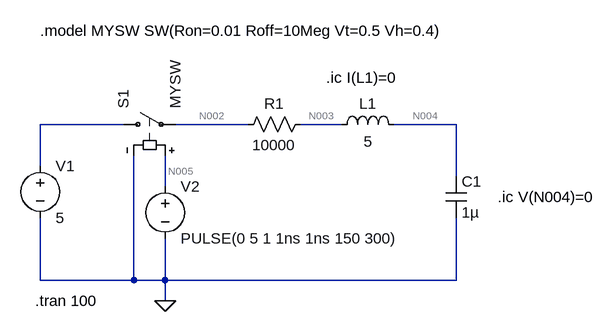
[diagram p0: schematic Transient_RLC.asc]
Transient_RLC.asc, the LTspice schematic file:
Version 4
SHEET 1 880 680
WIRE 64 64 -64 64
WIRE 256 64 144 64
WIRE 400 64 336 64
WIRE 576 64 480 64
WIRE -64 128 -64 64
WIRE 576 144 576 64
WIRE 128 160 128 112
WIRE -64 304 -64 208
WIRE 80 304 80 112
WIRE 80 304 -64 304
WIRE 128 304 128 240
WIRE 128 304 80 304
WIRE 576 304 576 208
WIRE 576 304 128 304
WIRE 128 336 128 304
FLAG 128 336 0
SYMBOL res 240 80 R270
WINDOW 0 32 56 VTop 2
WINDOW 3 0 56 VBottom 2
SYMATTR InstName R1
SYMATTR Value 10000
SYMBOL ind 384 80 R270
WINDOW 0 32 56 VTop 2
WINDOW 3 5 56 VBottom 2
SYMATTR InstName L1
SYMATTR Value 5
SYMBOL voltage -64 112 R0
SYMATTR InstName V1
SYMATTR Value 5
SYMBOL sw 48 64 R270
SYMATTR InstName S1
SYMATTR Value MYSW
SYMBOL voltage 128 144 R0
WINDOW 123 0 0 Left 0
WINDOW 39 0 0 Left 0
SYMATTR InstName V2
SYMATTR Value PULSE(0 5 1 1ns 1ns 150 300)
SYMBOL cap 560 144 R0
SYMATTR InstName C1
SYMATTR Value 1µ
TEXT -64 -80 Left 2 !.model MYSW SW(Ron=0.01 Roff=10Meg Vt=0.5 Vh=0.4)
TEXT -72 336 Left 2 !.tran 100
TEXT 376 -8 Left 2 !.ic I(L1)=0
TEXT 640 176 Left 2 !.ic V(N004)=0

The netlist it stands for:
* Transient_RLC.asc
R1 N002 N003 10000
L1 N003 N004 5
V1 N001 0 5
S1 N001 N002 N005 0 MYSW
V2 N005 0 PULSE(0 5 1 1ns 1ns 150 300)
C1 N004 0 1µ
.model MYSW SW(Ron=0.01 Roff=10Meg Vt=0.5 Vh=0.4)
.tran 100
.ic I(L1)=0
.ic V(N004)=0
.backanno
.end

* Results of the author's LTspice run, read from the files saved beside the schematic
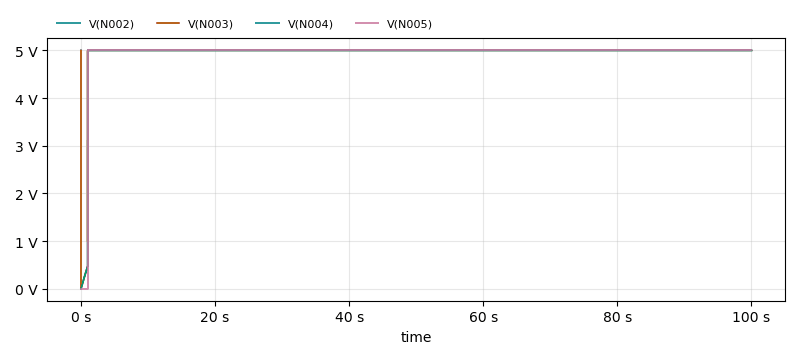
[diagram p1: Transient Analysis of Transient_RLC.asc, plotted from the saved traces]
* Transient Analysis, 1 run:
*   V(N002): min 4.984 mV, max 5 V, average 4.952 V, rms 4.975 V, last 5 V
*   V(N003): min -10.8 µV, max 5 V, average 4.952 V, rms 4.975 V, last 5 V
*   V(N004): min 0 V, max 5 V, average 4.952 V, rms 4.975 V, last 5 V
*   V(N005): min 0 V, max 5 V, average 4.95 V, rms 4.975 V, last 5 V